# Altium schematic sheet PCB-FirstFloor.SchDoc
size A4; SheetNumber: 15; SheetTotal: 15
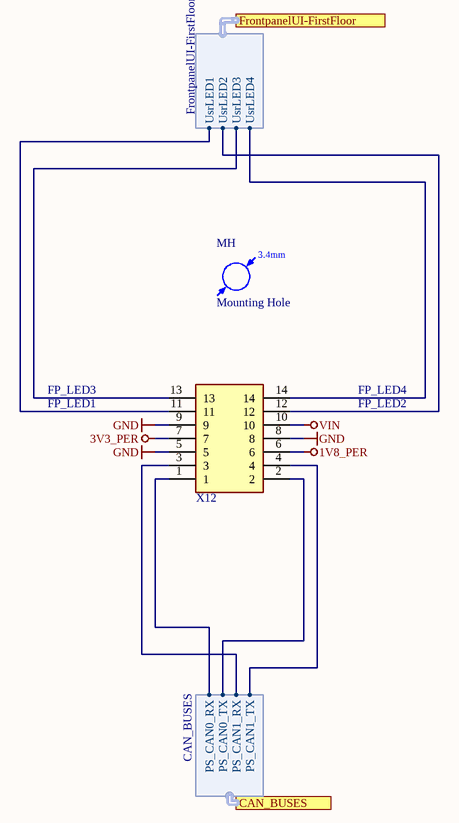
[diagram p0: PCB-FirstFloor.SchDoc]

## Parts
MH  Mounting Hole  [MH_3.4]  (no BOM)
X12  (no value)  [TE_215309-7]

## Ports
CAN_BUSES (harness CAN_BUSES), FrontpanelUI-FirstFloor (harness FrontpanelUI-FirstFloor)

## Harnesses
FrontpanelUI-FirstFloor: UsrLED1, UsrLED2, UsrLED3, UsrLED4
CAN_BUSES: PS_CAN0_RX, PS_CAN0_TX, PS_CAN1_RX, PS_CAN1_TX

## Nets
1V8_PER: X12.6
3V3_PER: X12.7
GND: X12.5 X12.8 X12.9
VIN: X12.10
NetX12_1: X12.1 ; port CAN_BUSES.PS_CAN0_RX
NetX12_2: X12.2 ; port CAN_BUSES.PS_CAN0_TX
NetX12_3: X12.3 ; port CAN_BUSES.PS_CAN1_RX
NetX12_4: X12.4 ; port CAN_BUSES.PS_CAN1_TX
NetX12_11: X12.11 ; port FrontpanelUI-FirstFloor.UsrLED1
NetX12_12: X12.12 ; port FrontpanelUI-FirstFloor.UsrLED2
NetX12_13: X12.13 ; port FrontpanelUI-FirstFloor.UsrLED3
NetX12_14: X12.14 ; port FrontpanelUI-FirstFloor.UsrLED4

## Notes on the sheet
- FP_LED1
- FP_LED3
- FP_LED2
- FP_LED4
- Title
- Revision:
- Design Engineer:
- Date:
- Project:
- Sheet
- of
- (in symbol Mounting Hole) 3.4mm

## Library data of the parts
MH = Mounting Hole: Created from: MHlatky; Manufacturer Part Number: Mounting Hole; PartID: 16; Created On: 26/01/2021 09:19:51; ComponentLink1Description: Datasheet; Component Type: Mounting Hole; Device Package: -; Last Updated: 21/03/2022 23:05:12; Manufacturer: Mounting Hole; Supplier 1: Mounting Hole; Supplier Part Number 1: Mounting Hole; Type: Mounting Hole; Value: Mounting Hole; Live Cycle Status: 1; Stock number: not stored
X12 = 2.54-2*7P: [low-cost] Headers & Wire Housings REC ASSY 2X7P VERT [NB: "2.54-2*7P" is not a unique MPN]; Manufacturer: Boom Precision Elec; Created from: FRosner/MGeier; Manufacturer Part Number: 2.54-2*7P; PartID: 42; Created On: 08/08/2024 12:14:20; ComponentLink1Description: Homepage; ComponentLink1URL: https://jlcpcb.com/partdetail/boomele_boom_Precision_elec-2_54_27P/C38844; ComponentLink2Description: Datasheet (related part, i.e., 16P version); ComponentLink2URL: https://wmsc.lcsc.com/wmsc/upload/file/pdf/v2/lcsc/2308171714_BOOMELE-Boom-Precision-Elec-2-54-2-8P_C30734.pdf; Last Updated: 08/08/2024 12:16:08; Mounting Type: THT; Supplier 1: LCSC; Supplier Part Number 1: C38844; Value: 2.54-2*7P; LCSC Part Number: C38844